# EAGLE design VI meter (EAGLE 8.6.3)

## Sheet 1 of 2
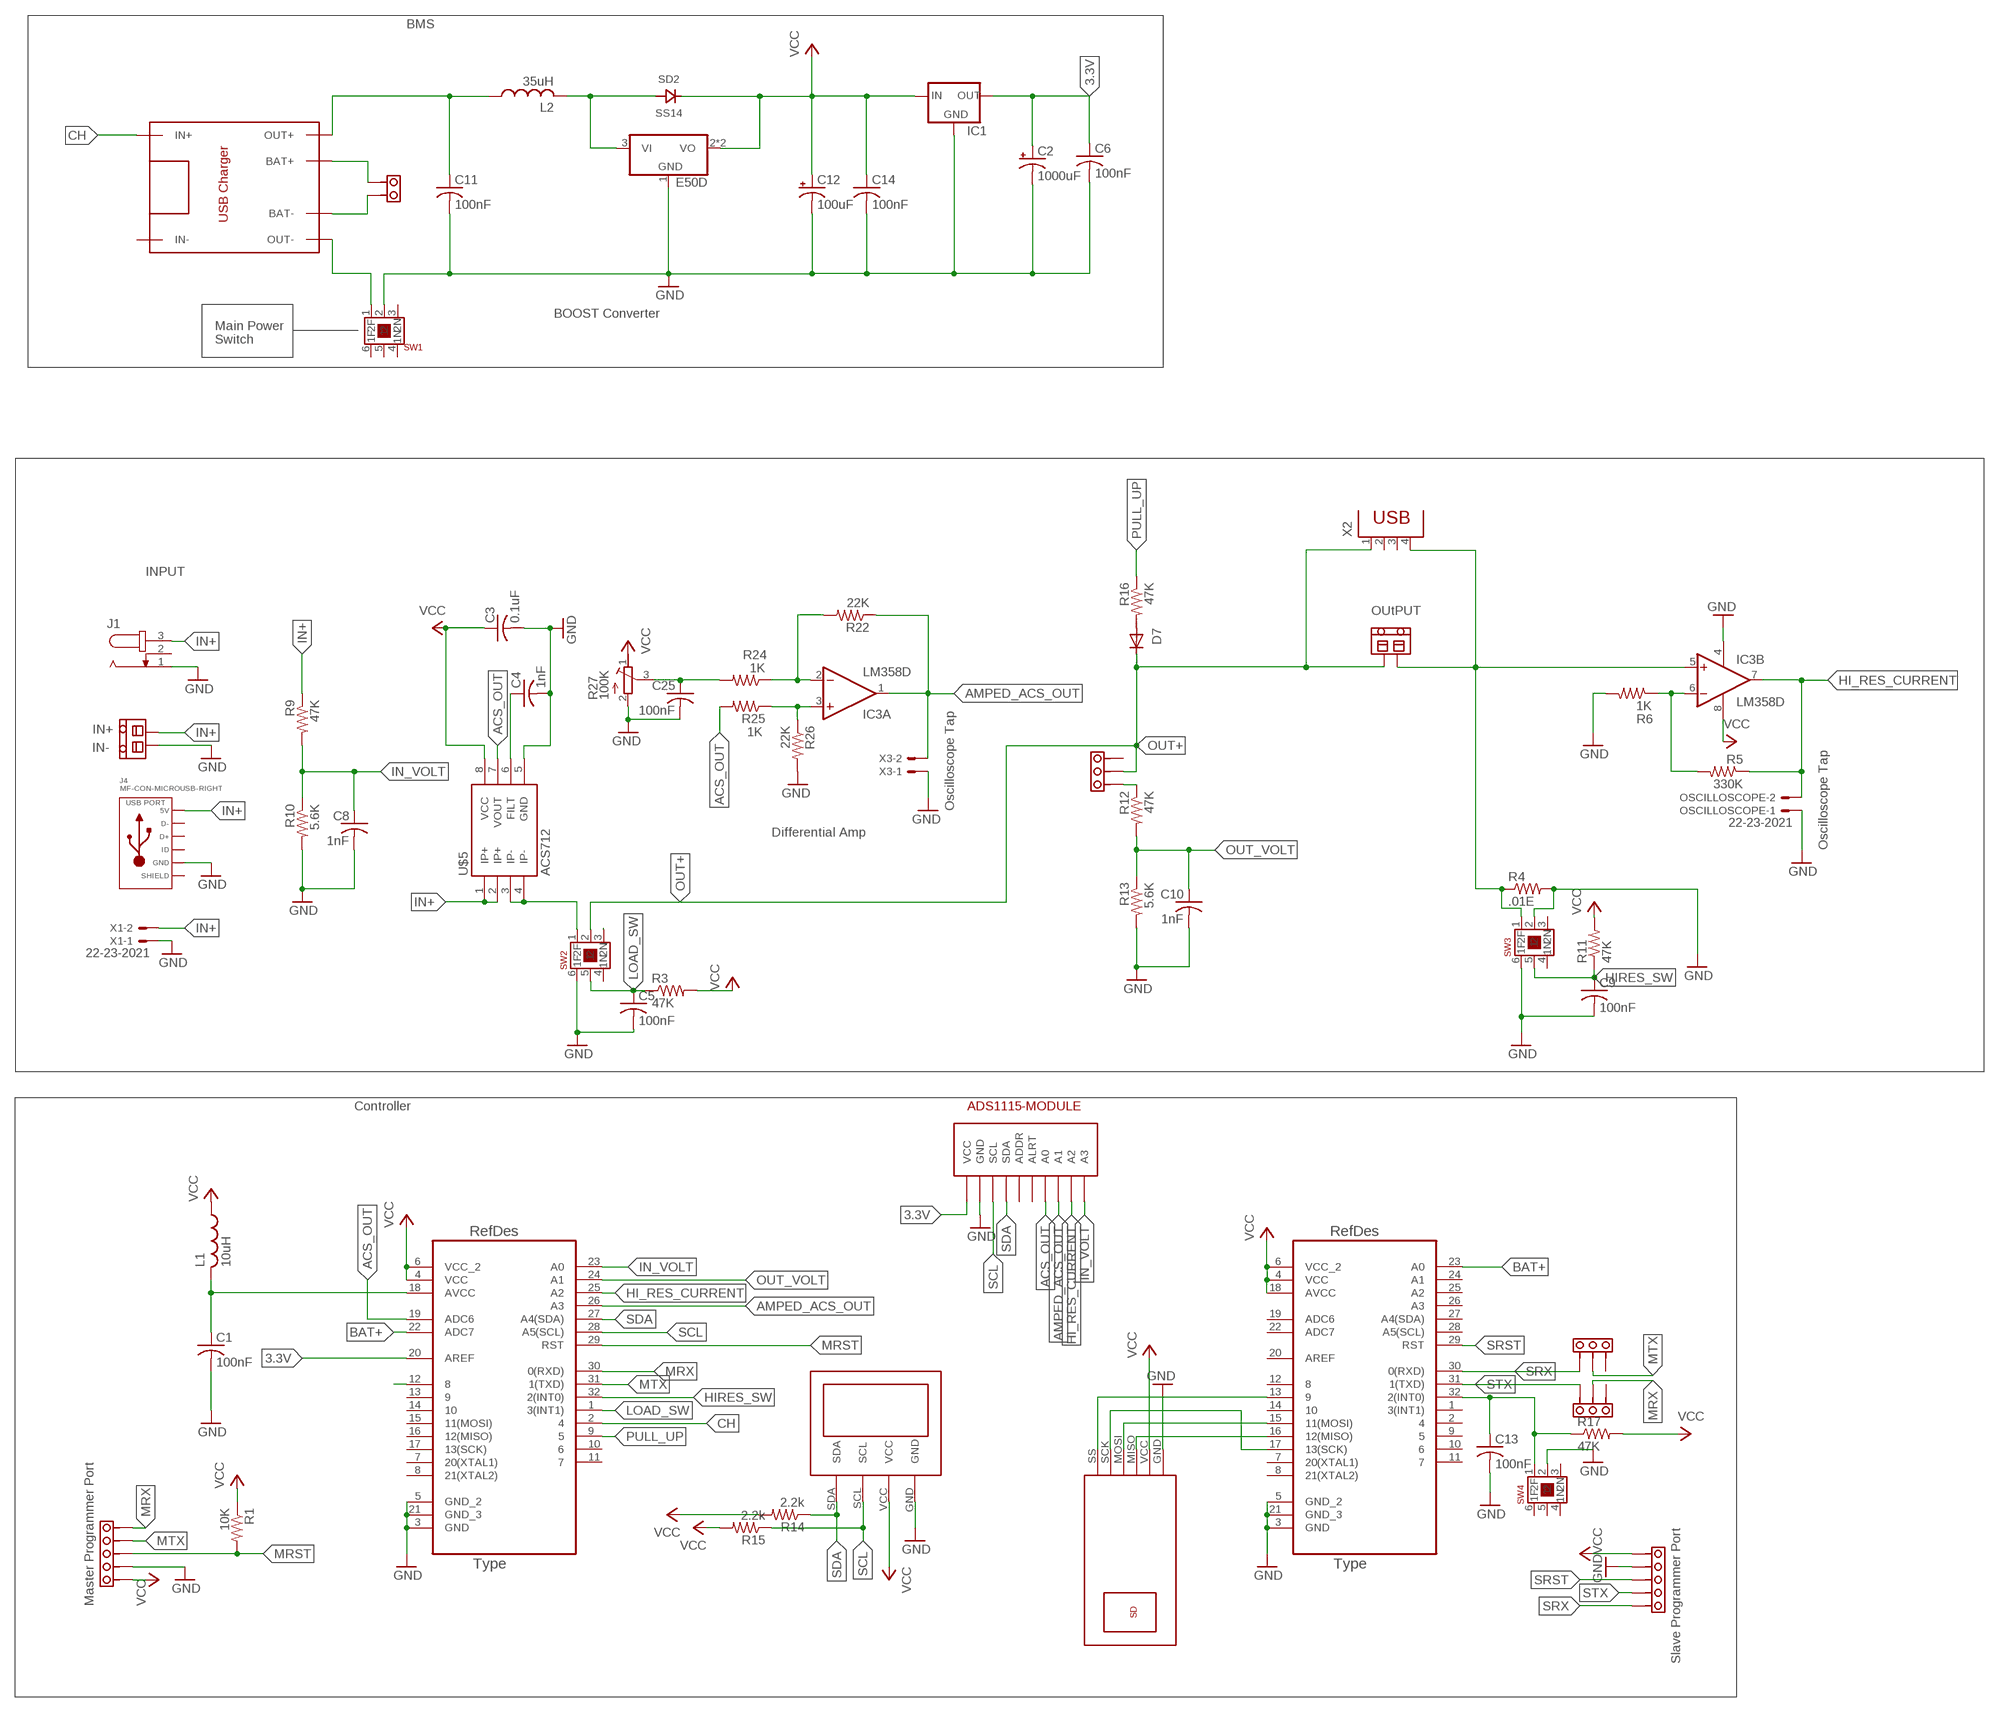
[diagram p0: schematic, sheet 1]

### Parts
C1  100nF  C-USC1206  [C1206]
C2  1000uF  CPOL-US153CLV-0807  [153CLV-0807]
C3  0.1uF  C-USC1206  [C1206]
C4  1nF  C-USC1206  [C1206]
C5  100nF  C-USC1206  [C1206]
C6  100nF  C-USC1206  [C1206]
C8  1nF  C-USC1206  [C1206]
C9  100nF  C-USC1206  [C1206]
C10  1nF  C-USC1206  [C1206]
C11  100nF  C-USC1206  [C1206]
C12  100uF  CPOL-US150CLZ-0810  [150CLZ-0810]
C13  100nF  C-USC1206  [C1206]
C14  100nF  C-USC1206  [C1206]
C25  100nF  C-USC1206  [C1206]
D7  DIODE-MINIMELF  [MINIMELF]
IC1  LM1117  [SOT223]
IC2  E50D  [SOT89]
IC3  LM358D  [SO08]
J1  JACK-PLUG1  [SPC4078]
J4  MF-CON-MICROUSB-RIGHT  USB_MICRO_RIGHT  [MICROUSB-RIGHT]
L1  10uH  L-US0207/10  [0207/10]
L2  35uH  L-USWE-TPC  [POWER-CHOKE_WE-TPC]
OSCILLOSCOPE  22-23-2021  [22-23-2021]
R1  10K  R-US_M1206  [M1206]
R3  47K  R-US_M1206  [M1206]
R4  .01E  R-US_0617/17  [0617/17]
R5  330K  R-US_M1206  [M1206]
R6  1K  R-US_M1206  [M1206]
R9  47K  R-US_M1206  [M1206]
R10  5.6K  R-US_M1206  [M1206]
R11  47K  R-US_M1206  [M1206]
R12  47K  R-US_M1206  [M1206]
R13  5.6K  R-US_M1206  [M1206]
R14  2.2k  R-US_M1206  [M1206]
R15  2.2k  R-US_M1206  [M1206]
R16  47K  R-US_M1206  [M1206]
R17  47K  R-US_M1206  [M1206]
R22  22K  R-US_M1206  [M1206]
R24  1K  R-US_M1206  [M1206]
R25  1K  R-US_M1206  [M1206]
R26  22K  R-US_M1206  [M1206]
R27  100K  TRIMMER_FLAT  [3386P]
SD2  SS14  [DO214]
SW1  PUSH_LATCH_SW_9X9  [PUSH_LATCH_SW_9X9]
SW2  Load Switch  PUSH_LATCH_SW_9X9  [PUSH_LATCH_SW_9X9]
SW3  Hi Res  PUSH_LATCH_SW_9X9  [PUSH_LATCH_SW_9X9]
SW4  Hi Res  PUSH_LATCH_SW_9X9  [PUSH_LATCH_SW_9X9]
U$1  TERMINAL_BLOCK  [TERMINAL_BLOCK]
U$2  MASTER  ATMEGA328P-AU-ARDIONO  [QFP80P900X900X120-32N]
U$3  TERMINAL_BLOCK  [TERMINAL_BLOCK]
U$4  BERG_5  [BERG_5]
U$5  ACS712  [SO08]
U$6  TP4056  [TP4056]
U$7  BERG_2  [BERG_2]
U$8  BERG_3  [BERG_3]
U$9  SLAVE  ATMEGA328P-AU-ARDIONO  [QFP80P900X900X120-32N]
U$10  MICROSD_ARDUINO  [MICROSD_ARDUINO]
U$11  BERG_5  [BERG_5]
U$12  OLED_0.96  [OLED_0.96]
U$13  ADS1115-MODULE  [ADS1115-MODULE]
U$14  BERG_3  [BERG_3]
U$15  BERG_3  [BERG_3]
X1  22-23-2021  [22-23-2021]
X2  PN87520  [PN87520]
X3  22-23-2021  [22-23-2021]

### Nets
3.3V: C2.+ C6.1 IC1.2(OUT) U$2.20(AREF) U$13.VCC
ACS_OUT: R25.2 U$2.19(ADC6) U$5.7(VOUT) U$13.A0
AMPED_ACS_OUT: IC3.1(A:OUT) R22.1 U$2.26(A3) U$13.A1 X3.2
BAT+: U$2.22(ADC7) U$6.BAT+ U$7.F U$9.23(A0)
BAT-: U$6.BAT- U$7.E
BOUT+: C11.1 L2.1 U$6.OUT+
CH: U$2.2 U$2.12 U$6.IN+
GND: C1.2 C2.- C3.2 C4.2 C5.2 C6.2 C8.2 C9.2 C10.2 C11.2 C12.- C13.2 C14.2 C25.2 IC1.1(GND) IC2.1(GND) IC3.4(P:V-) J1.1 J4.5(GND) OSCILLOSCOPE.1 R4.2 R6.2 R10.2 R13.2 R26.2 R27.2 SW1.2 SW2.6(2F) SW3.2 SW3.6(2F) SW4.2 U$1.2 U$2.3(GND) U$2.5(GND_2) U$2.21(GND_3) U$4.H U$5.5(GND) U$9.3(GND) U$9.5(GND_2) U$9.21(GND_3) U$10.GND U$11.H U$12.GND U$13.GND X1.1 X3.1
HI_RES_CURRENT: IC3.7(B:OUT) OSCILLOSCOPE.2 R5.1 U$2.25(A2) U$13.A2
HIRES_SW: C9.1 R11.1 SW3.5 U$2.32(2(INT0))
IN+: J1.3 J4.1(5V) R9.1 U$1.1 U$5.1(IP+) U$5.2(IP+) X1.2
IN_VOLT: C8.1 R9.2 R10.1 U$2.23(A0) U$13.A3
LOAD-: IC3.5(B:+IN) R4.1 SW3.1(1F) U$3.1 X2.4
LOAD_SW: C5.1 R3.1 SW2.5 U$2.1(3(INT1))
MRST: R1.2 U$2.29(RST) U$4.G
MRX: U$2.30(0(RXD)) U$4.E U$15.F
MTX: U$2.31(1(TXD)) U$4.F U$14.F
N$1: C1.1 L1.2 U$2.18(AVCC)
N$2: IC2.3(VI) L2.2 SD2.ANODE
N$3: C4.1 U$5.6(FILT)
N$4: IC3.6(B:-IN) R5.2 R6.1
N$5: R12.1 U$8.G
N$6: SW2.1(1F) U$5.3(IP-) U$5.4(IP-)
N$7: U$9.16(12(MISO)) U$10.MISO
N$8: U$9.15(11(MOSI)) U$10.MOSI
N$9: U$9.17(13(SCK)) U$10.SCK
N$10: SW2.3(1N)
N$11: D7.A R16.2
N$12: U$9.13 U$10.SS(CS)
N$13: C13.1 R17.1 SW4.1(1F) U$9.32(2(INT0))
N$26: IC3.2(A:-IN) R22.2 R24.1
N$29: IC3.3(A:+IN) R25.1 R26.1
OUT+: D7.C SW2.2 U$3.2 U$8.F X2.1
OUT-: SW1.1(1F) U$6.OUT-
OUT_VOLT: C10.1 R12.2 R13.1 U$2.24(A1)
POT_OFFSET: C25.1 R24.2 R27.3
PULL_UP: R16.1 U$2.9
SCL: R15.1 U$2.28(A5(SCL)) U$12.SCL U$13.SCL
SDA: R14.1 U$2.27(A4(SDA)) U$12.SDA U$13.SDA
SRST: U$9.29(RST) U$11.G
SRX: U$9.30(0(RXD)) U$11.E U$14.G
STX: U$9.31(1(TXD)) U$11.F U$15.E
VCC: C3.1 C12.+ C14.1 IC1.3(IN) IC2.2(VO) IC2.2@1(VO) IC3.8(P:V+) L1.1 R1.1 R3.2 R11.2 R14.2 R15.2 R17.2 R27.1 SD2.CATHODE U$2.4(VCC) U$2.6(VCC_2) U$4.I U$5.8(VCC) U$9.4(VCC) U$9.6(VCC_2) U$9.18(AVCC) U$10.VCC U$11.I U$12.VCC
Unconnected: J1.2 J4.2(D-) J4.3(D+) J4.4(ID) SW1.3(1N) SW1.4(2N) SW1.5 SW1.6(2F) SW2.4(2N) SW3.3(1N) SW3.4(2N) SW4.3(1N) SW4.4(2N) SW4.5 SW4.6(2F) U$2.7(20(XTAL1)) U$2.8(21(XTAL2)) U$2.10 U$2.11 U$2.13 U$2.14 U$2.15(11(MOSI)) U$2.16(12(MISO)) U$2.17(13(SCK)) U$6.IN- U$8.E U$9.1(3(INT1)) U$9.2 U$9.7(20(XTAL1)) U$9.8(21(XTAL2)) U$9.9 U$9.10 U$9.11 U$9.12 U$9.14 U$9.19(ADC6) U$9.20(AREF) U$9.22(ADC7) U$9.24(A1) U$9.25(A2) U$9.26(A3) U$9.27(A4(SDA)) U$9.28(A5(SCL)) U$13.ADDR U$13.ALRT U$14.E U$15.G X2.2 X2.3

### Notes on the sheet
- BMS
- BOOST Converter
- Main Power 
  Switch
- INPUT
- OUtPUT
- IN+
- IN-
- Oscilloscope Tap
- Differential Amp
- Oscilloscope Tap
- Controller
- Slave Programmer Port
- Master Programmer Port

## Sheet 2 of 2

## Power pins joined to a net without a drawn wire
SLD: J4.S1(SLD) J4.S2(SLD) J4.S3(SLD) J4.S4(SLD) J4.S5(SLD) J4.S6(SLD)

## Library data of the parts
C1 = rcl:C-US: CAPACITOR, American symbol; SPICEPREFIX: C
C2 = rcl:CPOL-US: POLARIZED CAPACITOR, American symbol; SPICEPREFIX: C
C3-C6 C8-C11 C13 C14 C25 = rcl:C-US: CAPACITOR, American symbol
C12 = rcl:CPOL-US: POLARIZED CAPACITOR, American symbol
D7 = diode:DIODE-: DIODE
IC1 = v-reg-3:LM1117
IC2 = dragCustom:E50D
IC3 = linear:LM358: OP AMP also LM158; LM258; LM2904 Source: http://cache.national.com/ds/LM/LM158.pdf
J1 = con-jack:JACK-PLUG: DC POWER JACK Power Jack, DC, Right Angle, Through Hole, Rated 5A at 16VDC, PC Terminals Distributor: Farnell (www.Farnell.de) Drawing: 84N1161.pdf / 84N1162.pdf Manufacturer: SPC Technology (www.spctechnology.com) Type: SPC4077 / SPC 4078; OC_FARNELL: unknown; OC_NEWARK: unknown
J4 = MicroUSB Connectors:USB: Library: MF_Connectors Description: 5 Pin USB Connectors. SLD is the shield connection. Usually tied to ground through a small ferrite bead.; HOUSEPART: YES; MPN: MF-CON-MICROUSB-RIGHT; POPULATE: 1; URL: https://factory.macrofab.com/part/MF-CON-MICROUSB-RIGHT
L1 = rcl:L-US: INDUCTOR, American symbol; SPICEPREFIX: L
L2 = rcl:L-US: INDUCTOR, American symbol
OSCILLOSCOPE X1 X3 = con-molex:22-23-2021: .100" (2.54mm) Center Header - 2 Pin; MF: MOLEX; MPN: 22-23-2021; OC_FARNELL: 1462926; OC_NEWARK: 25C3832
R1 R3-R6 R9-R17 R22 R24-R26 = rcl:R-US_: RESISTOR, American symbol; SPICEPREFIX: R
R27 = dragCustom:TRIMMER_FLAT
SD2 = ihpcb-diode:SS14
SW1-SW4 = dragCustom:PUSH_LATCH_SW_9X9
U$1 U$3 = dragCustom:TERMINAL_BLOCK
U$2 U$9 = ATmega328-AU:ATMEGA328P-AU-ARDIONO
U$4 U$11 = dragCustom:BERG_5
U$5 = SparkFun-AnalogIC:ACS712: Hall-effect-based isolated linear current sensor
U$6 = TP4056 charging module:TP4056
U$7 = dragCustom:BERG_2
U$8 U$14 U$15 = dragCustom:BERG_3
U$10 = dragCustom:MICROSD_ARDUINO
U$12 = dragCustom:OLED_0.96
U$13 = dragCustom:ADS1115-MODULE
X2 = con-berg:PN87520: BERG USB connector; OC_FARNELL: unknown; OC_NEWARK: unknown

## Board
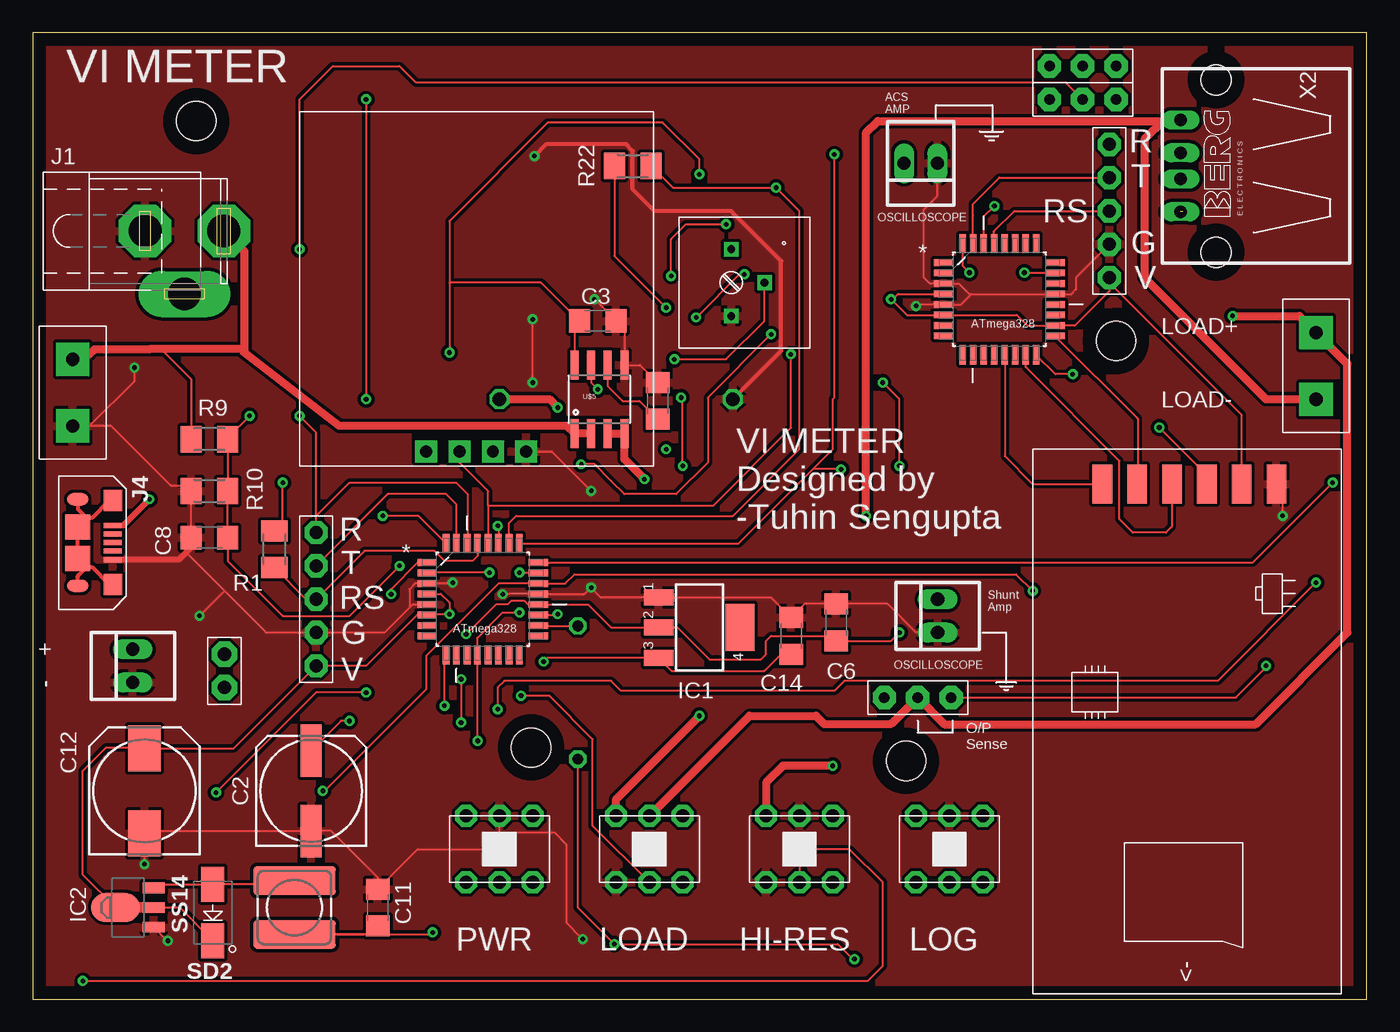
[diagram p1: board, top side]
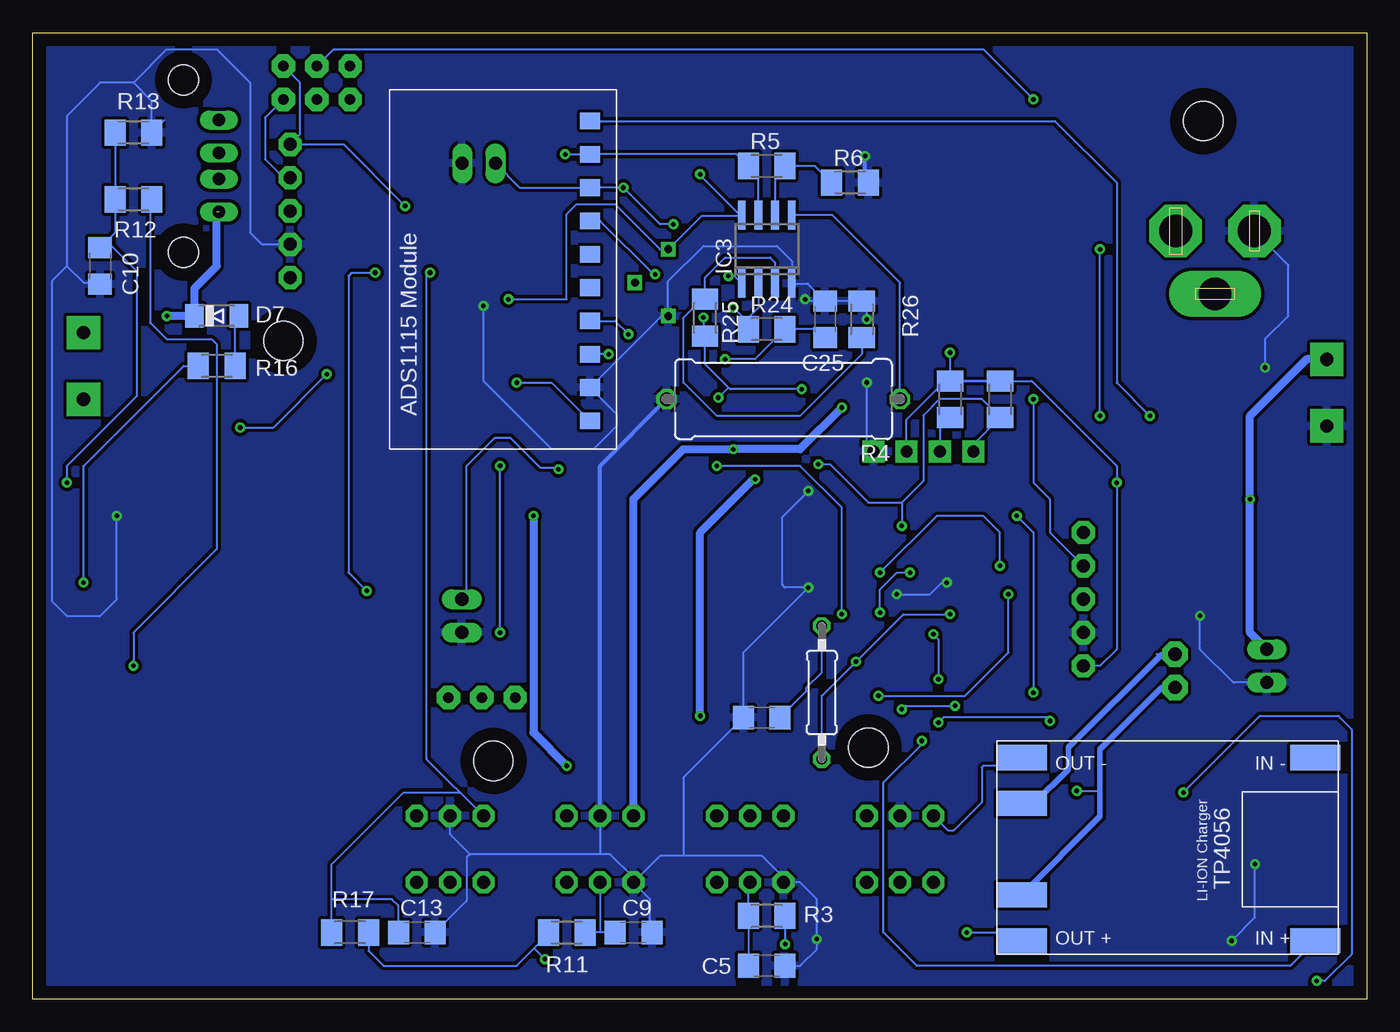
[diagram p2: board, bottom side, seen from below]

Size 101.65 x 73.65 mm. Coordinates in mm from the lower left corner, seen from the top.
Outline: 0,0 101.65,0 101.65,73.65 0,73.65 0,0
Copper layers (1*16): Top 0.035mm / dielectric 1.5mm / Bottom 0.035mm
Design rules "default *": minimum track width 6mil, minimum drill 24mil, track to track 8mil, track to pad 8mil, pad to pad 8mil, via to via 8mil, smd to smd 8mil, copper to edge 40mil, drill to drill 8mil, minimum pad ring 10mil, minimum via ring 8mil, stop-mask expansion 4mil, vias tented up to drill 0mil, thermal gap 10mil
Holes 3 mm at 12.45,66.93 82.55,50.16 66.55,18.16 37.97,19.18

### Footprints (pad centres in the part's own frame; a part is rotated, then mirrored left to right if it is on the bottom)
C1206 = smd 1.6 x 1.8: 1 -1.4,0; 2 1.4,0
153CLV-0807 = smd 4 x 1.6: + 3.05,0; - -3.05,0
150CLZ-0810 = smd 3.5 x 2.5: + 3.25,0; - -3.25,0
MINIMELF = smd 1.4 x 1.8: A 1.7,0; C -1.7,0
SOT223 = smd 1.219 x 2.235: 1 -2.311,-3.099; 2 0,-3.099; 3 2.311,-3.099 | smd 3.6 x 2.2: 4 0,3.099
SOT89 = smd 0.813 x 1.676: 1 -1.499,-1.981; 2 0,-1.981; 3 1.499,-1.981 | smd 2.2 x 3.7: 2@1 0,0.94
SO08 = smd 0.6 x 2.2: 1 -1.905,-2.6; 2 -0.635,-2.6; 3 0.635,-2.6; 4 1.905,-2.6; 5 1.905,2.6; 6 0.635,2.6; 7 -0.635,2.6; 8 -1.905,2.6
SPC4078 = drill 2.5 pad 4 octagon: 1 -3,0; 3 3,0 | drill 2.5 pad 3 long: 2 0,-4.8
MICROUSB-RIGHT = smd 0.4 x 1.35: 1 -1.3,1.27; 2 -0.65,1.27; 3 0,1.27; 4 0.65,1.27; 5 1.3,1.27 | smd 0.9 x 1.6: S1 -3.3,-1.4; S2 3.3,-1.4 | smd 1.6 x 1.4: S3 -3.2,1.27; S4 3.2,1.27 | smd 1.9 x 1.9: S5 -1.2,-1.405; S6 1.2,-1.405
0207/10 = drill 0.813 octagon: 1 -5.08,0; 2 5.08,0
POWER-CHOKE_WE-TPC = smd 6.3 x 2.2: 1 0,2.05; 2 0,-2.05
22-23-2021 = drill 1 long: 1 -1.27,0; 2 1.27,0
M1206 = smd 1.6 x 2: 1 -1.4,0; 2 1.4,0
0617/17 = drill 1.016 octagon: 1 -8.89,0; 2 8.89,0
3386P = drill 0.6 square: 1 -2.54,-1; 2 2.54,-1; 3 0,1.54
DO214 = smd 2.65 x 1.75: ANODE -2.15,0; CATHODE 2.15,0
PUSH_LATCH_SW_9X9 = drill 1 pad 1.676 octagon: 1 -2.54,2.54; 2 0,2.54; 3 2.54,2.54; 4 2.54,-2.54; 5 0,-2.54; 6 -2.54,-2.54
TERMINAL_BLOCK = drill 1 pad 2.54 square: 1 -2.54,0; 2 2.54,0
QFP80P900X900X120-32N = smd 1.473 x 0.508: 1 -4.242,2.794; 2 -4.242,2.007; 3 -4.242,1.194; 4 -4.242,0.406; 5 -4.242,-0.406; 6 -4.242,-1.194; 7 -4.242,-2.007; 8 -4.242,-2.794; 17 4.242,-2.794; 18 4.242,-2.007; 19 4.242,-1.194; 20 4.242,-0.406; 21 4.242,0.406; 22 4.242,1.194; 23 4.242,2.007; 24 4.242,2.794 | smd 0.508 x 1.473: 9 -2.794,-4.242; 10 -2.007,-4.242; 11 -1.194,-4.242; 12 -0.406,-4.242; 13 0.406,-4.242; 14 1.194,-4.242; 15 2.007,-4.242; 16 2.794,-4.242; 25 2.794,4.242; 26 2.007,4.242; 27 1.194,4.242; 28 0.406,4.242; 29 -0.406,4.242; 30 -1.194,4.242; 31 -2.007,4.242; 32 -2.794,4.242
BERG_5 = drill 1 pad 1.778 octagon: E 0,5.08; F 0,2.54; G 0,0; H 0,-2.54; I 0,-5.08
SO08' = smd 0.61 x 2.21: 1 -1.905,-2.616; 2 -0.635,-2.616; 3 0.635,-2.616; 4 1.905,-2.616; 5 1.905,2.616; 6 0.635,2.616; 7 -0.635,2.616; 8 -1.905,2.616
TP4056 = smd 1.93 x 3.81: BAT+ 5.39,-10.16; BAT- -1.58,-10.16; IN+ 8.89,12.2; IN- -5.08,12.2; OUT+ 8.89,-10.16; OUT- -5.08,-10.16
BERG_2 = drill 1 pad 1.93 octagon: E 0,2.54; F 0,0
BERG_3 = drill 0.8 pad 1.778 octagon: E 0,2.54; F 0,0; G 0,-2.54
MICROSD_ARDUINO = smd 3 x 1.5: GND -17.666,7.148; MISO -17.666,1.84; MOSI -17.666,-0.814; SCK -17.666,-3.468; SS -17.666,-6.122; VCC -17.666,4.494
OLED_0.96 = drill 0.9 pad 1.676 square: GND 3.31,-10.33; SCL -1.77,-10.33; SDA -4.31,-10.33; VCC 0.77,-10.33
ADS1115-MODULE = smd 1.27 x 1.524: A0 3.429,-5.588; A1 5.969,-5.588; A2 8.509,-5.588; A3 11.049,-5.588; ADDR -1.651,-5.588; ALRT 0.889,-5.588; GND -9.271,-5.588; SCL -6.731,-5.588; SDA -4.191,-5.588; VCC -11.811,-5.588
PN87520 = drill 0.95 long: 1 -3.5,2.71; 2 -1,2.71; 3 1,2.71; 4 3.5,2.71 | hole 2.3: -6.57,0; 6.57,0

### Placement (x,y rotation side)
C1  46.1,21.46 180 bottom
C2  21.21,15.88 90 top
C3  43.05,51.69 0 top
C4  47.62,45.59 90 top
C5  45.72,2.54 0 bottom
C6  61.21,28.7 90 top
C8  13.46,35.18 180 top
C9  55.88,5.08 0 bottom
C10  96.52,55.88 270 bottom
C11  26.29,6.99 90 top
C12  8.51,15.88 90 top
C13  72.39,5.08 0 bottom
C14  57.79,27.69 90 top
C25  41.28,51.82 90 bottom
D7  87.63,52.07 0 bottom
IC1  50.8,28.32 270 top
IC2  7.24,6.99 90 top
IC3  45.72,57.15 0 bottom
J1  11.56,58.55 0 top
J4  4.83,34.8 270 top
L1  41.53,23.37 90 bottom
L2  19.94,6.99 180 top
OSCILLOSCOPE  68.96,29.21 90 top
R1  18.41,34.29 270 top
R3  45.72,6.35 0 bottom
R4  44.45,45.72 180 bottom
R5  45.72,63.5 0 bottom
R6  39.37,62.23 0 bottom
R9  13.46,42.67 0 top
R10  13.46,38.73 180 top
R11  60.96,5.08 180 bottom
R12  93.98,60.96 180 bottom
R13  93.98,66.04 0 bottom
R14  27.94,45.72 90 bottom
R15  31.75,45.72 90 bottom
R16  87.63,48.26 0 bottom
R17  77.47,5.08 0 bottom
R22  45.72,63.5 180 top
R24  45.72,51.05 0 bottom
R25  50.42,51.94 270 bottom
R26  38.48,51.82 90 bottom
R27  54.23,54.61 270 top
SD2  13.72,6.6 270 top
SW1  35.56,11.43 0 top
SW2  46.99,11.43 0 top
SW3  58.42,11.43 0 top
SW4  69.85,11.43 0 top
U$1  3.05,46.23 270 top
U$2  34.29,30.48 0 top
U$3  97.79,48.26 90 top
U$4  21.59,30.48 0 top
U$5  ACS712  [SO08']  43.18,45.72 0 top
U$6  16.13,13.34 270 bottom
U$7  14.61,23.75 0 top
U$8  67.44,22.99 90 top
U$9  73.66,53.34 0 top
U$10  87.63,21.59 270 top
U$11  82.04,60.07 0 top
U$12  34.29,52.07 0 top
U$13  64.77,55.88 90 bottom
U$14  80.01,71.12 90 top
U$15  80.01,68.58 270 top
X1  7.62,25.4 90 top
X2  90.17,63.5 90 top
X3  67.67,63.7 180 top

### Tracks (layer width: path | path; a pad name or v marks a point on that pad's centre or on a via)
3.3V  (via drill 0.35)
  Top 0.152: v66.04,27.94 65.4,27.3 C6.1 60.83,27.69 56.26,27.69 55.88,27.3 55.88,26.29 55.5,25.91 51.56,25.91 49.15,28.32 IC1.2 44.07,28.32 42.32,30.07 U$2.20 37.74,30.07 37.47,30.35 36.45,30.35 36.2,30.1 35.31,30.1 v33.02,27.81 | v66.04,40.64 66.04,45.72 v64.77,46.99 | v24.13,21.21 23.49,21.21 C2.+ | v32.64,24.38 v32.64,21.08
  Bottom 0.152: v66.04,27.94 v66.04,40.64 | v64.77,46.99 62.1,46.99 U$13.VCC | v33.02,27.81 32.64,27.43 v32.64,24.38 32.64,24.26 | v24.13,21.21 24.38,21.46 32.26,21.46 v32.64,21.08
ACS_OUT  (via drill 0.35)
  Top 0.152: U$5.7 42.55,46.99 v43.05,46.48 | v54.23,55.24 53.85,55.24 50.57,51.96 v50.55,51.96 | U$2.19 39.95,29.29 v40.01,29.34 | v49.53,40.64 49.53,45.72 v49.4,45.85
  Bottom 0.152: v43.05,46.48 48.51,46.48 48.64,46.61 | 48.64,46.61 50.42,48.39 R25.2 50.55,50.67 v50.55,51.96 | U$13.A0 58.42,59.31 54.36,55.24 v54.23,55.24 | v40.01,29.34 40.01,37.46 43.18,40.64 v49.53,40.64 | v49.4,45.85 48.64,46.61
AMPED_ACS_OUT  (via drill 0.35)
  Top 0.152: R22.1 48.77,61.85 v56.64,61.85 58.42,60.07 58.42,41.91 53.34,36.83 36.83,36.83 36.3,36.3 U$2.26 | v48.64,55.12 48.64,57.91 49.78,59.05 v52.83,59.05
  Bottom 0.152: IC3.1 48.19,55.12 v48.64,55.12 | v52.83,59.05 53.85,59.05 v56.64,61.85 U$13.A1 64.54,61.85 X3.2
BAT+  (via drill 0.35)
  Top 0.152: v22.1,15.88 22.22,15.88 29.97,23.62 29.97,26.16 35.48,31.67 U$2.22 40.56,31.67 41.28,32.38 74.93,32.38 v76.2,31.11 | v75.56,55.37 77.88,55.37 U$9.23
  Bottom 0.152: v22.1,15.88 20.32,15.88 | v75.56,55.37 77.34,55.37 77.6,55.12 77.6,32.51 v76.2,31.11 | U$7.F 15.62,23.75
  Bottom 0.406: U$6.BAT+ 20.32,13.91 20.32,15.88 20.32,19.05 15.62,23.75
BAT-
  Bottom 0.152: 25.96,15.24 U$6.BAT- | U$7.E 16,26.29
  Bottom 0.406: U$7.E 15.62,26.29 22.73,19.18 22.73,17.53 25.34,14.91 U$6.BAT-
BOUT+  (via drill 0.35)
  Top 0.152: C11.1 25.64,4.94 L2.1 30.34,4.94 v30.48,5.08
  Bottom 0.152: v30.48,5.08 26.92,5.08 U$6.OUT+
CH  (via drill 0.35)
  Top 0.152: v33.91,19.68 33.91,26.21 U$2.12 33.88,27.53 35.81,29.46 v37.08,29.46 | v34.8,32.51 30.07,32.51 U$2.2
  Bottom 0.152: U$6.IN+ 5.83,2.54 34.29,2.54 36.83,5.08 36.83,16.51 33.91,19.43 v33.91,19.68 | v37.08,29.46 37.08,31.24 35.81,32.51 v34.8,32.51
GND  (via drill 0.35)
  Top 0.152: 35.56,12.7 34.29,11.43 29.33,11.43 C11.2 26.29,9.27 22.73,12.82 C2.- 8.71,12.82 C12.- | 35.56,12.7 SW1.2 | IC2.1 10.13,4.57 10.16,4.57 v10.29,4.45 | v8.51,10.29 C12.- | 28.7,29.84 26.8,27.94 U$4.H 17.78,27.94 14.61,31.11 | 28.7,29.84 28.96,30.1 30.02,30.1 U$2.5 | 28.7,29.84 28.7,31.24 29.13,31.67 U$2.3 31.93,31.67 v32,31.75 | 11.68,34.04 12.06,34.41 C8.2 R10.2 11.68,39.12 10.54,39.12 5.97,43.69 U$1.2 4.32,43.69 7.75,47.12 v7.75,48.13 | 11.68,34.04 14.61,31.11 | 35.56,12.7 39.75,12.7 40.64,11.81 40.64,5.84 v41.91,4.57 | v35.81,30.86 36.35,30.89 U$2.21 42.06,30.89 v42.55,31.37 43.28,30.63 IC1.1 56.24,30.63 C14.2 58.8,30.1 C6.2 65.15,30.1 67.31,27.94 OSCILLOSCOPE.1 | U$12.GND 39.54,41.74 v42.55,38.73 | 71.44,53.66 70.71,52.93 U$9.5 67.41,52.93 v67.31,52.83 | 71.44,53.66 71.53,53.75 U$9.21 79.15,53.75 79.5,54.1 79.5,54.99 U$11.H | 71.44,53.66 70.56,54.53 U$9.3 68.38,54.53 67.92,54.99 67.92,60.17 68.94,61.19 X3.1 | U$10.GND 94.78,39.37 95.25,38.9 v95.25,36.83 | v38.1,46.99 v38.1,51.82 | v12.7,29.21 14.61,31.11 | C12.- 9.45,12.62 | 7.34,33.5 11.15,33.5 11.68,34.04 | C4.2 46.28,48.34 U$5.5 45.09,51.06 C3.2 v42.8,53.34
  Top 0.305: 7.37,33.53 7.34,33.5 J4.5 | R4.2 57.02,49.4 57.02,56.26 53.21,60.07 47.37,60.07 45.72,61.72 45.72,64.64 45.21,65.15 39.12,65.15 v38.23,64.26
  Top 0.406: J4.5 11.15,33.5 12.06,34.41
  Bottom 0.152: v10.29,4.45 8.51,6.22 v8.51,10.29 | C25.2 40.9,53.6 | 40.9,53.6 40.64,53.85 | C25.2 42.61,54.55 IC3.4 43.82,56.26 44.96,57.4 50.55,57.4 53.23,54.72 R27.2 53.72,52.07 U$13.GND 57.15,44.58 57.15,43.69 58.93,41.91 62.1,41.91 67.31,47.12 v67.31,52.83 67.31,52.96 | 54.61,5.21 54.61,7.62 SW3.6 | 40.9,53.6 40.52,53.22 R26.2 38.1,52.84 v38.1,51.82 | C5.2 43.18,2.54 41.91,3.81 v41.91,4.57 41.91,7.62 43.18,8.89 SW2.6 44.45,9.27 46.1,10.92 52.07,10.92 | 52.07,10.92 53.85,10.92 SW3.6 | SW3.6 55.88,9.27 57.66,11.05 58.42,11.05 | 58.42,11.05 68.33,11.05 | SW4.2 69.85,12.57 68.33,11.05 | 68.33,11.05 68.58,10.8 68.58,7.49 C13.2 | 52.07,10.92 52.07,16.89 C1.2 47.5,26.41 v42.55,31.37 44.32,31.37 44.58,31.62 44.58,36.7 v42.55,38.73 | v35.81,30.86 33.27,30.86 32.38,31.75 v32,31.75 | 93.98,69.85 92.58,68.45 R13.2 91.62,67 | 93.98,69.85 96.52,69.85 99.06,67.31 99.06,55.88 | 99.06,55.88 97.79,54.61 96.65,54.61 C10.2 | U$12.GND 38.1,42.24 v38.1,46.99 | v95.25,36.83 95.25,30.48 96.52,29.21 99.06,29.21 100.18,30.33 100.18,54.76 99.06,55.88 | J1.1 5.97,55.96 5.97,52.07 7.75,50.29 v7.75,48.13 | 12.7,27.18 v12.7,29.21 12.7,26.67 10.16,24.13 X1.1 | U$11.H 84.2,57.53 85.09,58.42 85.09,69.85 87.63,72.39 91.44,72.39 93.98,69.85 | SW3.2 58.42,11.05 | R6.2 38.23,62.49 | C25.2 42.68,53.22 v42.8,53.34
  Bottom 0.305: 38.23,62.49 v38.23,64.26 | SW3.2 58.42,40.64 R4.2
  Bottom 0.61: C9.2 54.61,5.21
  pour Top (isolate 0.254): 0,73.66 101.6,73.66 101.6,0 0,0
  pour Bottom (isolate 0.254): 0,73.66 101.6,73.66 101.6,0 0,0
HI_RES_CURRENT  (via drill 0.35)
  Top 0.152: U$2.25 53.77,34.72 59.31,40.26 59.44,40.39 | 59.44,40.39 60.96,41.91 60.96,45.72 61.09,45.85 v61.09,64.39 | v61.6,40.39 59.44,40.39
  Bottom 0.152: IC3.7 46.36,62.73 R5.1 48.01,64.39 U$13.A2 v61.09,64.39 | OSCILLOSCOPE.2 68.58,30.86 68.58,40.64 66.42,42.8 65.28,42.8 62.99,40.51 61.72,40.51 v61.6,40.39
HIRES_SW  (via drill 0.35)
  Top 0.152: U$2.32 29.39,36.83 v26.67,36.83 | v3.81,1.39 63.62,1.39 64.77,2.54 64.77,8.89 62.23,11.43 59.69,11.43 58.42,10.16 SW3.5 | v25.4,23.37 21.59,23.37 v13.97,15.75
  Bottom 0.152: C9.1 58.42,5.08 | 58.42,5.08 R11.1 | SW3.5 58.42,5.08 | v26.67,36.83 25.4,35.56 v25.4,23.37 | v3.81,1.39 3.18,1.39 1.14,3.43 1.14,20.57 2.16,21.59 8.13,21.59 v13.97,15.75
IN+  (via drill 0.35)
  Top 0.152: 16,49.4 16.13,49.53 | 9.78,49.53 12.06,47.25 R9.1
  Top 0.305: 9.78,49.53 8.89,49.53
  Top 0.406: J4.1 6.89,36.1 v8.89,38.1
  Top 0.61: U$5.2 U$5.1 40.69,43.69 23.37,43.69 16,49.4 | J1.3 16.13,56.98 16.13,49.53 8.89,49.53 4.7,49.53 4.32,49.15 U$1.1
  Bottom 0.61: U$1.1 4.57,48.77 8.89,44.45 v8.89,38.1 8.89,27.94 X1.2
IN_VOLT  (via drill 0.35)
  Top 0.152: v16.51,44.45 14.86,42.8 R9.2 R10.1 C8.1 14.86,33.4 19.05,29.21 24.13,29.21 v27.94,33.02 | v37.08,32.51 38.51,32.51 U$2.23
  Bottom 0.152: U$13.A3 23.75,66.93 19.05,62.23 19.05,46.99 v16.51,44.45 | v27.94,33.02 27.94,35.56 29.21,36.83 32.77,36.83 v37.08,32.51
LOAD-  (via drill 0.35)
  Top 0.152: 87.25,67 86.18,67
  Top 0.61: R4.1 39.37,45.72 v40.01,45.09 | 86.18,67 84.71,65.53 84.71,54.99 93.98,45.72 U$3.1 | v63.5,36.83 63.5,66.04 64.39,66.93 87.18,66.93 87.25,67 X2.4 | v60.96,17.78 57.15,17.78 55.88,16.51 SW3.1
  Bottom 0.152: R4.1 35.56,54.61 40.7,59.75 IC3.5
  Bottom 0.61: SW3.1 55.88,38.1 52.07,41.91 v48.26,41.91 43.18,41.91 v40.01,45.09 | v63.5,36.83 63.5,20.32 v60.96,17.78
LOAD_SW  (via drill 0.35)
  Top 0.152: SW2.5 42.67,13.21 42.67,19.81 39.37,23.11 v37.21,23.11 | v27.3,30.86 27.3,31.24 29.34,33.27 U$2.1
  Bottom 0.152: SW2.5 47.12,8.76 R3.1 C5.1 | v37.21,23.11 30.61,23.11 27.3,26.42 v27.3,30.86
MRST
  Top 0.152: U$2.29 33.88,33.76 33.53,33.4 31.37,33.4 30.61,34.16 25.27,34.16 U$4.G 20.82,30.48 R1.2
MRX  (via drill 0.35)
  Top 0.152: U$2.30 33.15,34.77 33.15,38.48 32.26,39.37 24.13,39.37 21.59,36.83 U$4.E 21.59,43.18 v20.32,44.45 | v20.32,57.15 20.32,68.58 22.86,71.12 27.94,71.12 29.21,69.85 78.74,69.85 U$15.F
  Bottom 0.152: v20.32,44.45 v20.32,57.15
MTX  (via drill 0.35)
  Top 0.152: U$2.31 32.28,37.69 31.5,38.48 27.05,38.48 U$4.F | v25.4,68.58 v25.4,45.72
  Bottom 0.152: U$14.F 78.74,72.39 29.21,72.39 v25.4,68.58 | v25.4,45.72 25.4,39.37 24.13,38.1 24.13,35.56 U$4.F
N$1
  Top 0.152: U$2.18 38.56,28.45 L1.2
  Bottom 0.152: L1.2 41.53,24.89 42.68,23.75 42.68,23.49 C1.1
  Bottom 0.305: C1.1
N$2
  Top 0.152: L2.2 19.66,8.75 SD2.ANODE 9.49,8.75 IC2.3
N$3
  Top 0.152: U$5.6 43.82,46.74 44.96,45.59 46.23,45.59 C4.1
N$4
  Bottom 0.152: R6.1 42.04,63.5 R5.2 45.09,62.73 IC3.6
N$5  (via drill 0.35)
  Top 0.152: U$8.G 91.69,22.99 93.98,25.27 v93.98,25.4
  Bottom 0.152: v93.98,25.4 93.98,27.94 87.63,34.29 87.63,49.91 88.01,50.29 91.44,50.29 92.71,51.56 92.71,60.83 R12.1
N$6  (via drill 0.35)
  Top 0.61: U$5.3 U$5.4 45.09,41.15 v46.61,39.62 | SW2.1 44.45,15.24 v50.8,21.59
  Bottom 0.152: 46.74,39.62 v46.61,39.62
  Bottom 0.61: v50.8,21.59 50.8,35.56 46.74,39.62
N$7  (via drill 0.35)
  Top 0.152: U$10.MISO 89.47,39.94 v85.85,43.56 | v79.25,47.62 77.93,47.62 U$9.16
  Bottom 0.152: v85.85,43.56 83.31,43.56 v79.25,47.62
N$8
  Top 0.152: U$10.MOSI 86.82,36.02 86.36,35.56 83.82,35.56 82.8,36.58 82.8,41.02 75.67,48.16 U$9.15
N$9
  Top 0.152: U$9.17 84.2,44.25 84.2,39.3 U$10.SCK
N$11
  Bottom 0.152: R16.2 86.23,51.77 D7.A
N$12
  Top 0.152: U$9.13 74.07,41.38 76.19,39.26 U$10.SS
N$13  (via drill 0.35)
  Top 0.152: v71.37,55.37 70.87,55.88 U$9.32
  Bottom 0.152: R17.1 78.87,7.62 | 78.87,7.62 78.87,10.28 73.41,15.75 69.09,15.75 SW4.1 71.63,18.29 71.63,55.12 v71.37,55.37 | C13.1 73.79,7.12 74.3,7.62 78.87,7.62
N$26  (via drill 0.35)
  Top 0.152: R22.2 44.32,56.64 v48.26,52.7
  Bottom 0.152: IC3.2 46.36,52.7 47.12,51.94 47.12,51.56 | R24.1 47.12,51.44 47.12,51.56 | v48.26,52.7 47.12,51.56
N$29
  Bottom 0.152: IC3.3 45.09,56.13 45.47,56.52 48.9,56.52 50.42,54.99 R25.1 50.67,53.34 52.07,51.94 52.07,46.99 49.53,44.45 43.18,44.45 38.48,49.15 R26.1
OUT+  (via drill 0.35)  (1 unrouted)
  Top 0.61: SW2.2 54.61,21.59 59.69,21.59 60.33,20.95 65.35,20.95 65.38,20.98 65.43,20.98 U$8.F 69.47,20.95 93.19,20.95 100.18,27.94 100.18,48.41 U$3.2 96.52,52.07 v91.44,52.07
  Bottom 0.152: 89.33,51.64 D7.C
  Bottom 0.61: 87.63,60 87.63,55.88 89.33,54.18 D7.C v91.44,52.07
OUT-
  Bottom 0.152: U$6.OUT- 26.92,17.78 29.21,17.78 29.34,17.65 29.34,14.99 31.5,12.83 31.88,12.83 SW1.1
OUT_VOLT  (via drill 0.35)
  Top 0.152: U$2.24 92.96,33.27 v99.06,39.37
  Bottom 0.152: R13.1 R12.2 95.38,58.42 96.01,57.79 | 96.01,57.79 C10.1 | 96.01,57.79 93.73,55.5 93.73,45.97 99.06,40.64 v99.06,39.37
POT_OFFSET  (via drill 0.35)
  Top 0.152: v48.9,48.77 52.83,48.77 55.75,51.69 55.75,54.59 R27.3
  Bottom 0.152: C25.1 41.91,51.05 R24.2 46.61,48.77 v48.9,48.77
PULL_UP  (via drill 0.35)
  Top 0.152: v97.79,31.75 90.3,24.26 61.85,24.26 61.09,23.49 44.83,23.49 44.07,24.26 35.94,24.26 35.43,23.75 v35.43,22.1 | v31.37,22.35 31.37,26.11 U$2.9
  Bottom 0.152: v97.79,31.75 97.79,40.64 90.17,48.26 R16.1 88.9,48.26 | v35.43,22.1 35.18,22.35 v31.37,22.35
SCL  (via drill 0.35)
  Top 0.152: 34.7,37.59 U$2.28 | v57.76,49.15 57.76,49.25 57.79,49.28 57.79,43.56 51.82,37.59 34.7,37.59 | 34.7,37.59 34.7,38.71 32.52,40.89 U$12.SCL
  Bottom 0.152: R15.1 32.52,43.55 U$12.SCL | v57.76,49.15 U$13.SCL
SDA  (via drill 0.35)
  Top 0.152: v35.43,36.07 35.48,36.02 U$2.27 | v56.26,50.67 51.44,45.85 51.44,40.89 49.02,38.48 45.09,38.48 44.07,39.5 44.01,39.56 42.8,40.77 v41.78,40.77
  Bottom 0.152: U$12.SDA 29.98,42.28 R14.1 29.34,45.72 32.55,45.72 33.78,44.48 33.78,39.5 35.43,37.85 | 35.43,37.85 v35.43,36.07 | U$13.SDA 57.28,51.69 v56.26,50.67 | v41.78,40.77 40.89,40.77 37.97,37.85 35.43,37.85
SLD
  Top 0.305: 4.1,36.67 4.52,36.67 5.84,38 J4.S3 | 4.1,36.67 J4.S5 J4.S6 4.1,32.92 | 4.1,32.92 4.52,32.92 5.84,31.6 J4.S4 | J4.S1 3.43,37.35 4.1,36.67 | J4.S2 3.43,32.25 4.1,32.92
SRST
  Top 0.152: 73.28,57.61 U$9.29 73.25,58.52 74.8,60.07 U$11.G
SRX  (via drill 0.35)
  Top 0.152: 72.39,57.66 72.45,57.59 | 72.45,57.59 U$9.30 | v73.28,60.45 72.45,59.63 72.45,57.59
  Bottom 0.152: U$14.G 81.28,69.85 81.28,65.91 U$11.E 77.98,65.15 v73.28,60.45
STX
  Top 0.152: U$9.31 71.65,59.69 71.65,60.6 73.66,62.61 U$11.F
  Bottom 0.152: U$15.E 83.95,67.18 83.95,64.01 82.55,62.61 U$11.F
VCC  (via drill 0.35)
  Top 0.152: C12.+ 8.81,19.12 9.02,18.93 | SD2.CATHODE 11.18,6.99 IC2.2 IC2.2@1 3.81,9.47 3.81,17.4 5.59,19.18 8.46,19.18 C12.+ | U$2.4 31.09,30.89 31.75,30.23 v31.75,29.34 30.1,29.34 U$2.6 29.29,29.29 25.4,25.4 U$4.I 15.31,19.12 C12.+ | v62.61,3.05 62.48,3.05 61.34,4.19 v44.32,4.19 41.53,6.99 L1.1 | v50.8,62.87 50.8,64.01 48.01,66.8 39.24,66.8 31.75,59.31 31.75,54.61 | 31.75,54.61 v31.75,49.28 | U$9.4 65.94,53.75 65.53,53.34 v65.41,53.34 66.6,52.15 U$9.6 74.98,52.15 75.79,51.33 U$9.18 79.4,51.33 82.04,53.98 82.04,54.61 | v38.93,25.72 39.22,26.01 IC1.3 48.69,25.02 55.75,25.02 57.02,26.29 C14.1 | U$11.I 82.04,54.61 | U$10.VCC 92.12,44.53 82.04,54.61 | U$5.8 41.28,51.31 C3.1 38.73,54.61 31.75,54.61 | R1.1 18.92,35.69 19.05,35.56 v19.05,39.37
  Bottom 0.152: IC3.8 47.69,59.69 | R27.1 50.69,59.69 47.69,59.69 | R27.1 | L1.1 41.53,23.11 v38.93,25.72 35.31,29.34 v31.75,29.34 31.62,29.34 | U$12.VCC 35.06,44.19 32.13,47.12 R15.2 | R14.2 R15.2 | R27.1 53.86,57.16 57.28,60.58 60.2,60.58 60.96,59.82 60.96,53.34 v65.41,53.34 | R17.2 76.07,3.68 74.93,2.54 64.77,2.54 63.44,3.87 | 63.44,3.87 62.36,4.95 R11.2 | R3.2 44.32,4.58 44.32,4.57 v44.32,4.19 | v62.61,3.05 63.44,3.87 | R15.2 25.53,47.12 19.05,40.64 v19.05,39.37 19.05,26.67 20.32,25.4 U$4.I | 47.69,59.69 50.8,62.8 v50.8,62.87 50.8,62.99 | v31.75,49.28 R15.2

### Text on the board
tPlace: ACS / AMP | OSCILLOSCOPE | ATmega328 | LOAD+ | LOAD- | Shunt / Amp | ATmega328 | + | - | O/P / Sense | PWR | LOAD | HI-RES | LOG
tNames: VI METER | R | T | RS | G | V | VI METER / Designed by / -Tuhin Sengupta | R | T | RS | G | V
tStop: BAT- | BAT+